# EAGLE schematic WirelessTransceiverUSB_Rev- (EAGLE 9.6.2)

## Sheet 1 of 2
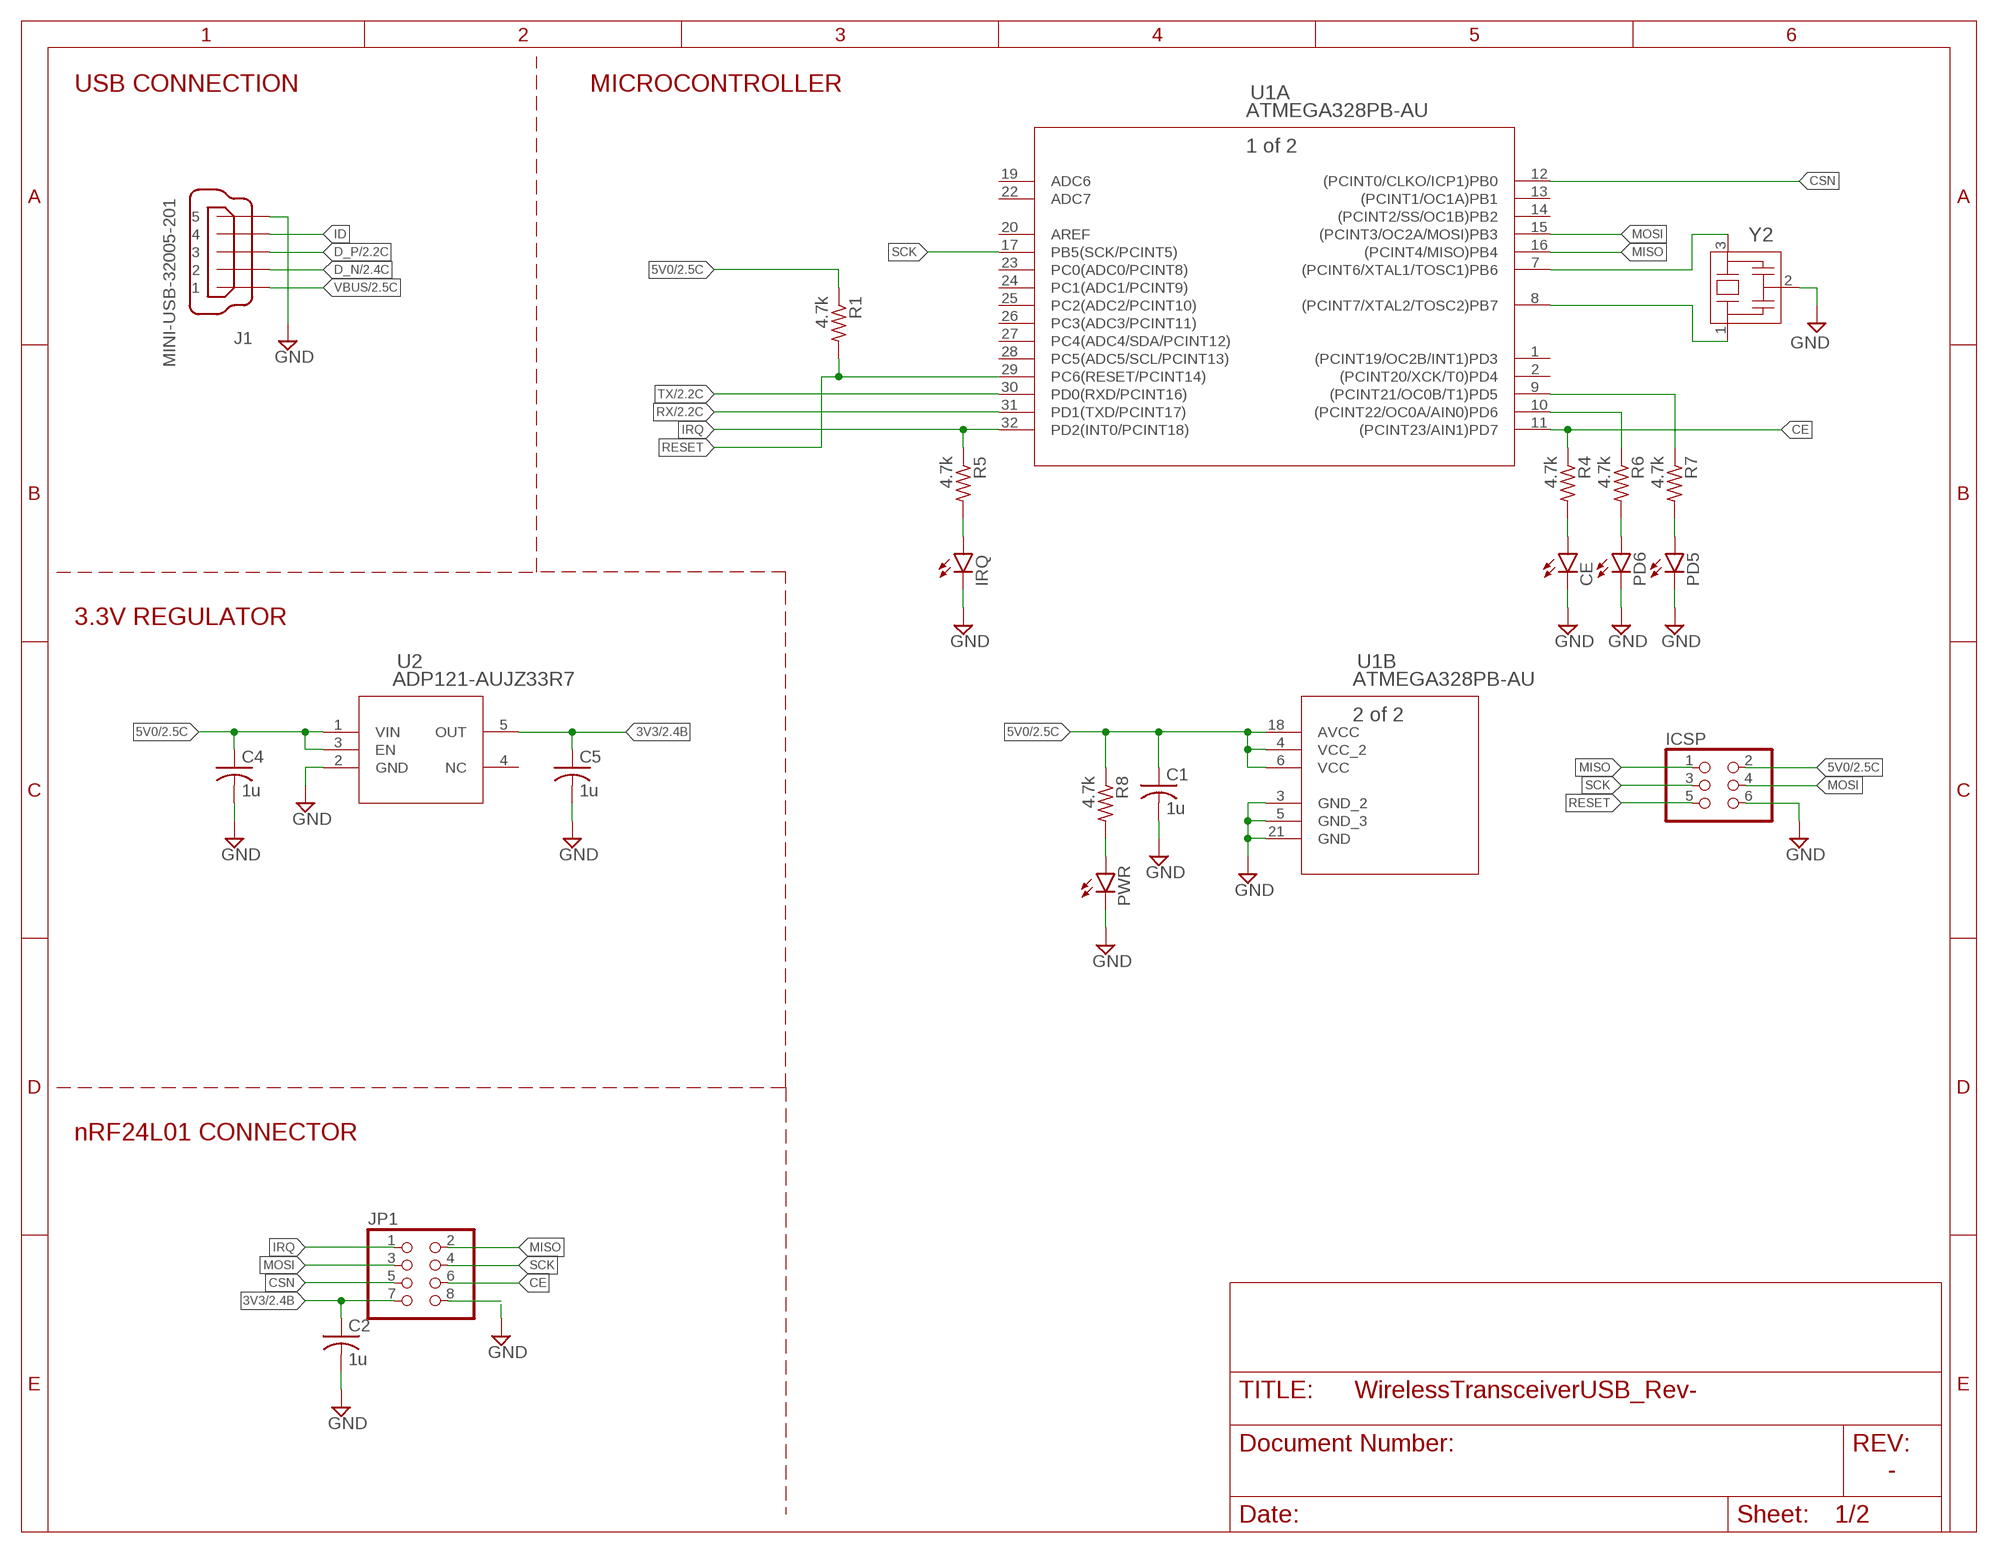
[diagram p0: schematic, sheet 1]

### Parts
C1  1u  C-USC0805  [C0805]
C2  1u  C-USC0805  [C0805]
C4  1u  C-USC0805  [C0805]
C5  1u  C-USC0805  [C0805]
CE  LEDSML0805  [SML0805]
ICSP  PINHD-2X3  [2X03]
IRQ  LEDSML0805  [SML0805]
J1  MINI-USB-32005-201  [32005-201]
JP1  PINHD-2X4  [2X04]
PD5  LEDSML0805  [SML0805]
PD6  LEDSML0805  [SML0805]
PWR  LEDSML0805  [SML0805]
R1  4.7k  R-US_R0805  [R0805]
R4  4.7k  R-US_R0805  [R0805]
R5  4.7k  R-US_R0805  [R0805]
R6  4.7k  R-US_R0805  [R0805]
R7  4.7k  R-US_R0805  [R0805]
R8  4.7k  R-US_R0805  [R0805]
U1  ATMEGA328PB-AU  [32A_MCH]
U2  ADP121-AUJZ33R7  [UJ_5_ADI]
Y2  CSTNE16M0V530000R0  [CSTNE16M0V530000R0_MUR]

### Nets
3V3: C2.1 C5.1 JP1.7 U2.5(OUT) ; also sheet 2
5V0: C1.1 C4.1 ICSP.2 R1.1 R8.1 U1.4(B:VCC_2) U1.6(B:VCC) U1.18(B:AVCC) U2.1(VIN) U2.3(EN) ; also sheet 2
CE: JP1.6 R4.1 U1.11(A:(PCINT23/AIN1)PD7)
CSN: JP1.5 U1.12(A:(PCINT0/CLKO/ICP1)PB0)
D_N [diff]: J1.2 ; also sheet 2
D_P [diff]: J1.3 ; also sheet 2
GND: C1.2 C2.2 C4.2 C5.2 CE.C ICSP.6 IRQ.C J1.5 JP1.8 PD5.C PD6.C PWR.C U1.3(B:GND_2) U1.5(B:GND_3) U1.21(B:GND) U2.2(GND) Y2.2 ; also sheet 2
ID: J1.4
IRQ: JP1.1 R5.1 U1.32(A:PD2(INT0/PCINT18))
MISO: ICSP.1 JP1.2 U1.16(A:(PCINT4/MISO)PB4)
MOSI: ICSP.4 JP1.3 U1.15(A:(PCINT3/OC2A/MOSI)PB3)
N$2: U1.7(A:(PCINT6/XTAL1/TOSC1)PB6) Y2.3
N$3: U1.8(A:(PCINT7/XTAL2/TOSC2)PB7) Y2.1
N$5: CE.A R4.2
N$6: IRQ.A R5.2
N$7: PD5.A R7.2
N$8: PD6.A R6.2
N$9: PWR.A R8.2
PD5: R7.1 U1.9(A:(PCINT21/OC0B/T1)PD5)
PD6: R6.1 U1.10(A:(PCINT22/OC0A/AIN0)PD6)
RESET: ICSP.5 R1.2 U1.29(A:PC6(RESET/PCINT14))
RX: U1.31(A:PD1(TXD/PCINT17)) ; also sheet 2
SCK: ICSP.3 JP1.4 U1.17(A:PB5(SCK/PCINT5))
TX: U1.30(A:PD0(RXD/PCINT16)) ; also sheet 2
VBUS: J1.1 ; also sheet 2
Unconnected: U1.1(A:(PCINT19/OC2B/INT1)PD3) U1.2(A:(PCINT20/XCK/T0)PD4) U1.13(A:(PCINT1/OC1A)PB1) U1.14(A:(PCINT2/SS/OC1B)PB2) U1.19(A:ADC6) U1.20(A:AREF) U1.22(A:ADC7) U1.23(A:PC0(ADC0/PCINT8)) U1.24(A:PC1(ADC1/PCINT9)) U1.25(A:PC2(ADC2/PCINT10)) U1.26(A:PC3(ADC3/PCINT11)) U1.27(A:PC4(ADC4/SDA/PCINT12)) U1.28(A:PC5(ADC5/SCL/PCINT13)) U2.4(NC)

### Notes on the sheet
- USB CONNECTION | MICROCONTROLLER
- 3.3V REGULATOR
- nRF24L01 CONNECTOR
- -

## Sheet 2 of 2
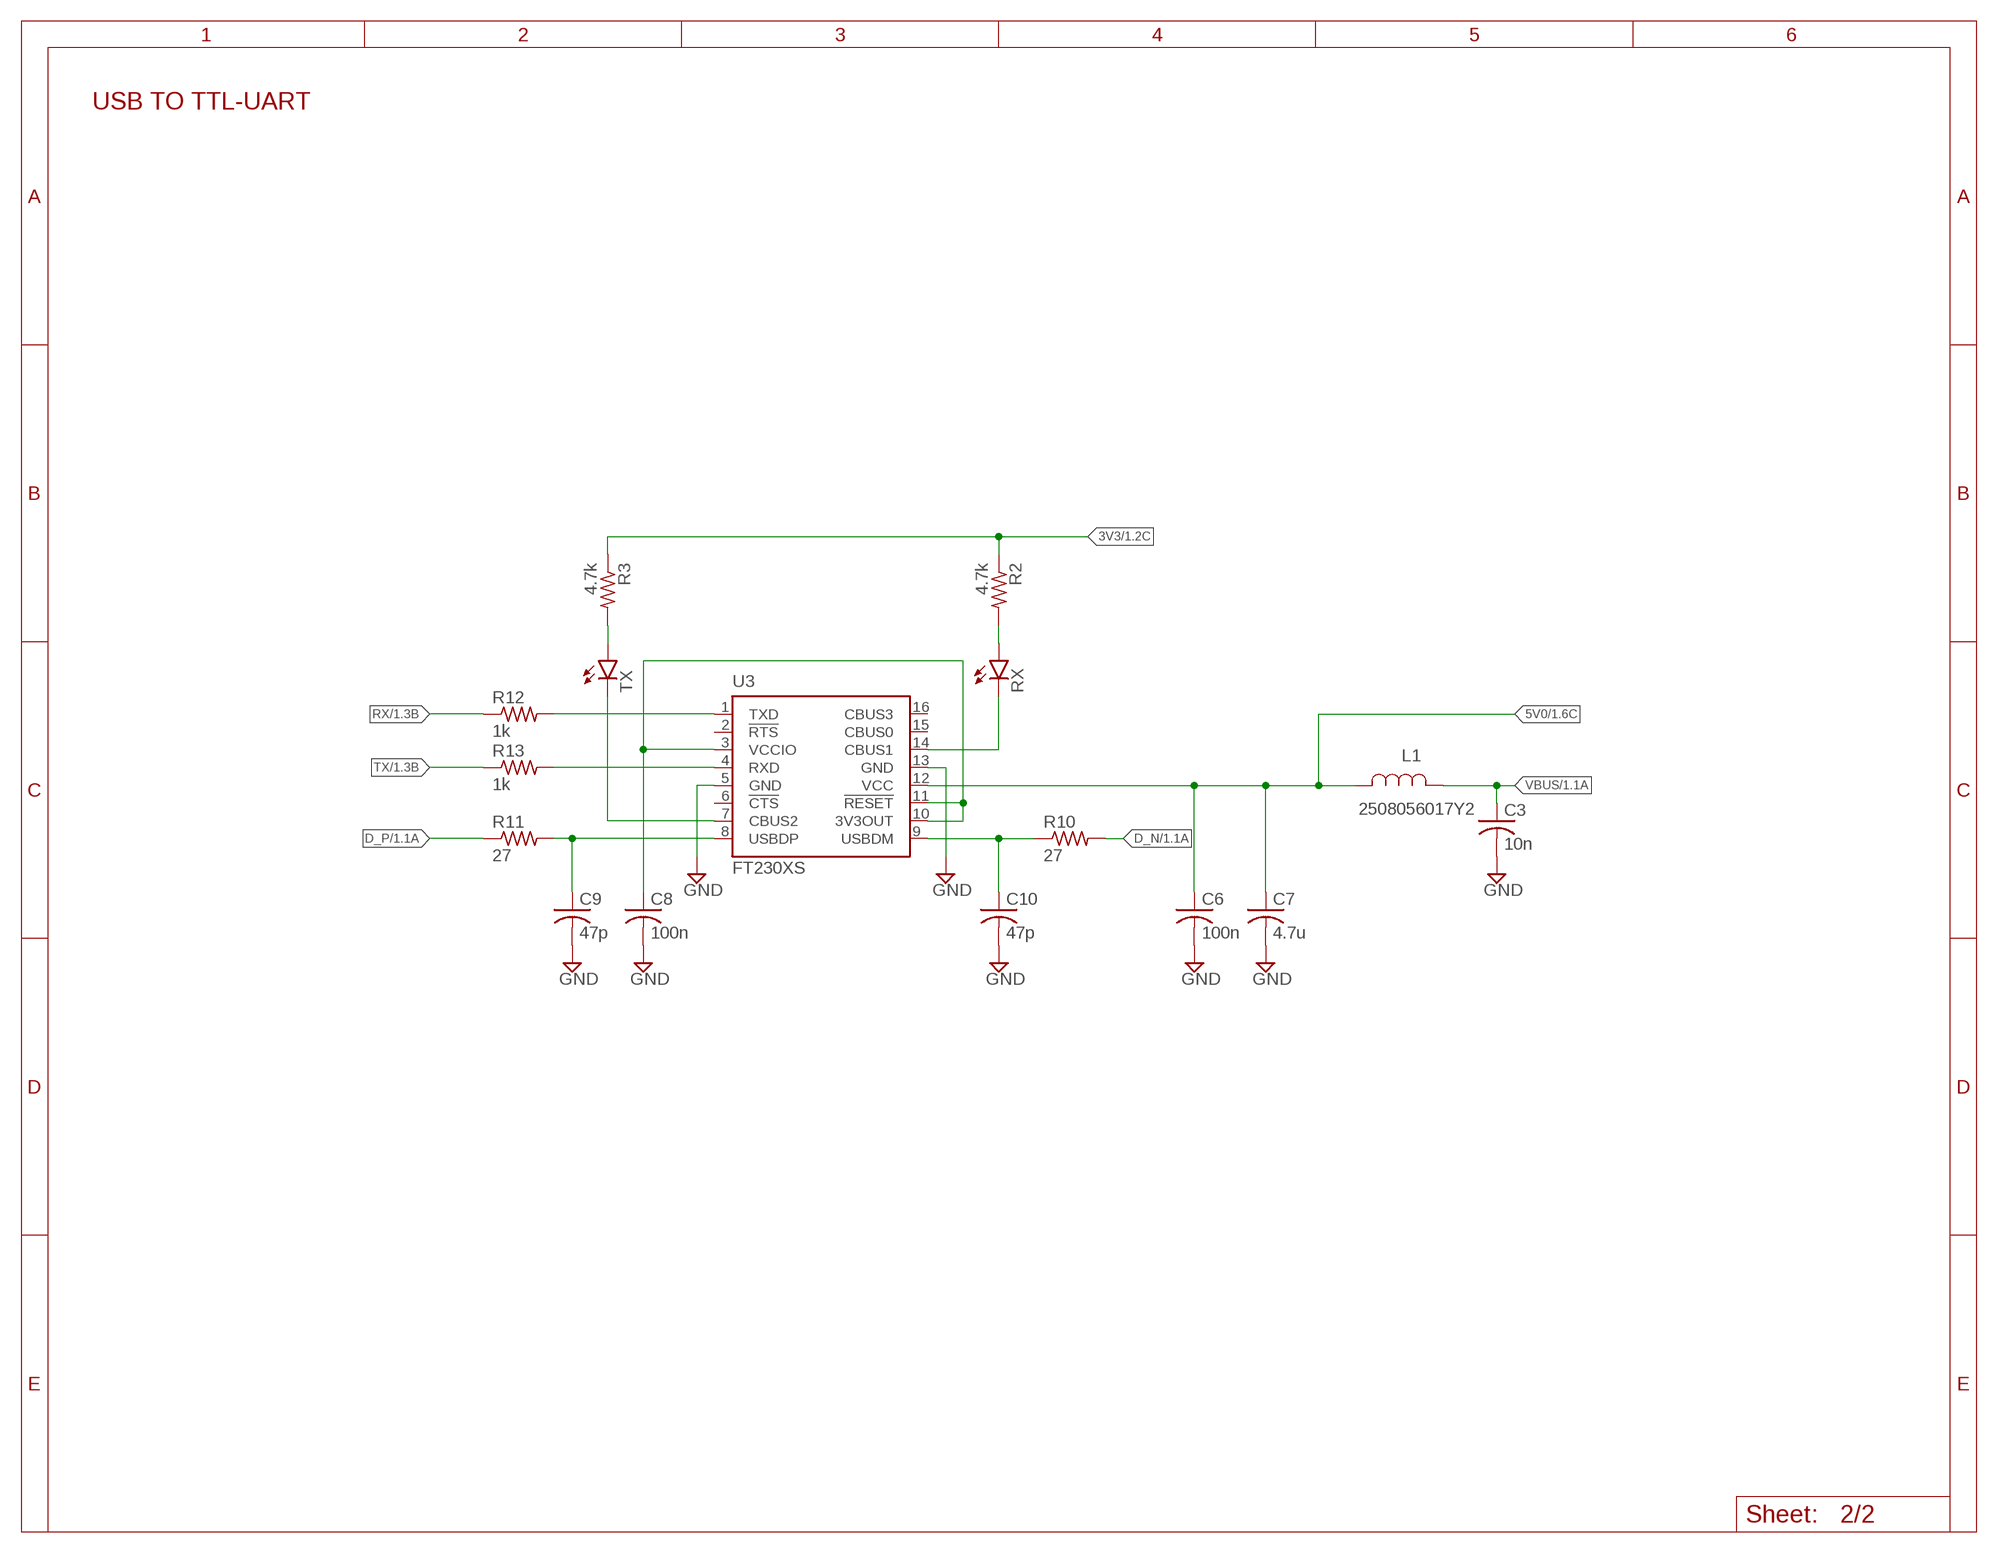
[diagram p1: schematic, sheet 2]

### Parts
C3  10n  C-USC0805  [C0805]
C6  100n  C-USC0805  [C0805]
C7  4.7u  C-USC0805  [C0805]
C8  100n  C-USC0805  [C0805]
C9  47p  C-USC0603  [C0603]
C10  47p  C-USC0603  [C0603]
L1  2508056017Y2  [IND_25_0805_FRT]
R2  4.7k  R-US_R0805  [R0805]
R3  4.7k  R-US_R0805  [R0805]
R10  27  R-US_R0603  [R0603]
R11  27  R-US_R0603  [R0603]
R12  1k  R-US_R0805  [R0805]
R13  1k  R-US_R0805  [R0805]
RX  LEDSML0805  [SML0805]
TX  LEDSML0805  [SML0805]
U3  FT230XS  [SSOP16]

### Nets
3V3: R2.1 R3.1 ; also sheet 1
5V0: C6.1 C7.1 L1.2 U3.12(VCC) ; also sheet 1
D_N [diff]: R10.2 ; also sheet 1
D_P [diff]: R11.1 ; also sheet 1
GND: C3.2 C6.2 C7.2 C8.2 C9.2 C10.2 U3.5(GND) U3.13(GND) ; also sheet 1
N$1: R2.2 RX.A
N$4: R3.2 TX.A
N$11: C8.1 U3.3(VCCIO) U3.10(3V3OUT) U3.11(!RESET)
N$13: TX.C U3.7(CBUS2)
N$14: RX.C U3.14(CBUS1)
N$15: R12.2 U3.1(TXD)
N$16: R13.2 U3.4(RXD)
RX: R12.1 ; also sheet 1
TX: R13.1 ; also sheet 1
USBD_N [diff]: C10.1 R10.1 U3.9(USBDM)
USBD_P [diff]: C9.1 R11.2 U3.8(USBDP)
VBUS: C3.1 L1.1 ; also sheet 1
Unconnected: U3.2(!RTS) U3.6(!CTS) U3.15(CBUS0) U3.16(CBUS3)

### Notes on the sheet
- USB TO TTL-UART
- Sheet:

## Library data of the parts
C1-C10 = rcl:C-US: CAPACITOR, American symbol
CE IRQ PD5 PD6 PWR RX TX = led:LED: LED OSRAM: - CHIPLED LG R971, LG N971, LY N971, LG Q971, LY Q971, LO R971, LY R971 LH N974, LH R974 LS Q976, LO Q976, LY Q976 LO Q996 - Hyper CHIPLED LW Q18S LB Q993, LB Q99A, LB R99A - SideLED LS A670, LO A670, LY A670, LG A670, LP A670 LB A673, LV A673, LT A673, LW A673 LH A674 LY A675 LS A676, LA A676, LO A676, LY A676, LW A676 LS A679, LY A679, LG A679 - Hyper Micro SIDELED® LS Y876, LA Y876, LO Y876, LY Y876 LT Y87S - SmartLED LW L88C, LW L88S LB L89C, LB L89S, LG L890 LS L89K, LO L89K, LY L89K LS L896, LA L896, LO L896, LY L896 - TOPLED LS T670, LO T670, LY T670, LG T670, LP T670 LSG T670, LSP T670, LSY T670, LOP T670, LYG T670 LG T671, LOG T671, LSG T671 LB T673, LV T673, LT T673, LW T673 LH T674 LS T676, LA T676, LO T676, LY T676, LB T676, LH T676, LSB T676, LW T676 LB T67C, LV T67C, LT T67C, LS T67K, LO T67K, LY T67K, LW E67C LS E67B, LA E67B, LO E67B, LY E67B, LB E67C, LV E67C, LT E67C LW T67C LS T679, LY T679, LG T679 LS T770, LO T770, LY T770, LG T770, LP T770 LB T773, LV T773, LT T773, LW T773 LH T774 LS E675, LA E675, LY E675, LS T675 LS T776, LA T776, LO T776, LY T776, LB T776 LHGB T686 LT T68C, LB T68C - Hyper Mini TOPLED® LB M676 - Mini TOPLED Santana® LG M470 LS M47K, LO M47K, LY M47K Source: http://www.osram.convergy.de LUXEON: - LUMILED® LXK2-PW12-R00, LXK2-PW12-S00, LXK2-PW14-U00, LXK2-PW14-V00 LXK2-PM12-R00, LXK2-PM12-S00, LXK2-PM14-U00 LXK2-PE12-Q00, LXK2-PE12-R00, LXK2-PE12-S00, LXK2-PE14-T00, LXK2-PE14-U00 LXK2-PB12-K00, LXK2-PB12-L00, LXK2-PB12-M00, LXK2-PB14-N00, LXK2-PB14-P00, LXK2-PB14-Q00 LXK2-PR12-L00, LXK2-PR12-M00, LXK2-PR14-Q00, LXK2-PR14-R00 LXK2-PD12-Q00, LXK2-PD12-R00, LXK2-PD12-S00 LXK2-PH12-R00, LXK2-PH12-S00 LXK2-PL12-P00, LXK2-PL12-Q00, LXK2-PL12-R00 Source: www.luxeon.com KINGBRIGHT: KA-3528ASYC Source: www.kingbright.com
ICSP = pinhead:PINHD-2X3: PIN HEADER
J1 = con-cypressindustries:MINI-USB-: MINI USB-B Conector Source: www.cypressindustries.com; OC_FARNELL: unknown; OC_NEWARK: unknown
JP1 = pinhead:PINHD-2X4: PIN HEADER
L1 = rcl:2508056017Y2; COPYRIGHT: Copyright (C) 2023 Ultra Librarian. All rights reserved.; MANUFACTURER_PART_NUMBER: 2508056017Y2; MFR_NAME: Fair-Rite
R1-R8 R10-R13 = rcl:R-US_: RESISTOR, American symbol
U1 = microchip:ATMEGA328PB-AU; COPYRIGHT: Copyright (C) 2023 Ultra Librarian. All rights reserved.; MANUFACTURER_PART_NUMBER: ATMEGA328PB-AU; MFR_NAME: Microchip
U2 = linear:ADP121-AUJZ33R7; COPYRIGHT: Copyright (C) 2023 Ultra Librarian. All rights reserved.; MANUFACTURER_PART_NUMBER: ADP121-AUJZ33R7; MFR_NAME: Analog Devices Inc
U3 = ftdichip:FT230X: USB to BASIC UART IC Auto generated by make-symbol-device-package-bsdl.ulp Rev. 43 Source: Data sheet <http://www.ftdichip.com/Support/Documents/DataSheets/ICs/DS_FT230X.pdf>
Y2 = murata:CSTNE16M0V530000R0; COPYRIGHT: Copyright (C) 2023 Ultra Librarian. All rights reserved.; MANUFACTURER_PART_NUMBER: CSTNE16M0V530000R0; MFR_NAME: Murata

## Net classes
1 diff: width 0.152 mm